# Altium project Tracking Radar PCB.PrjPcb (part 1 of 2)
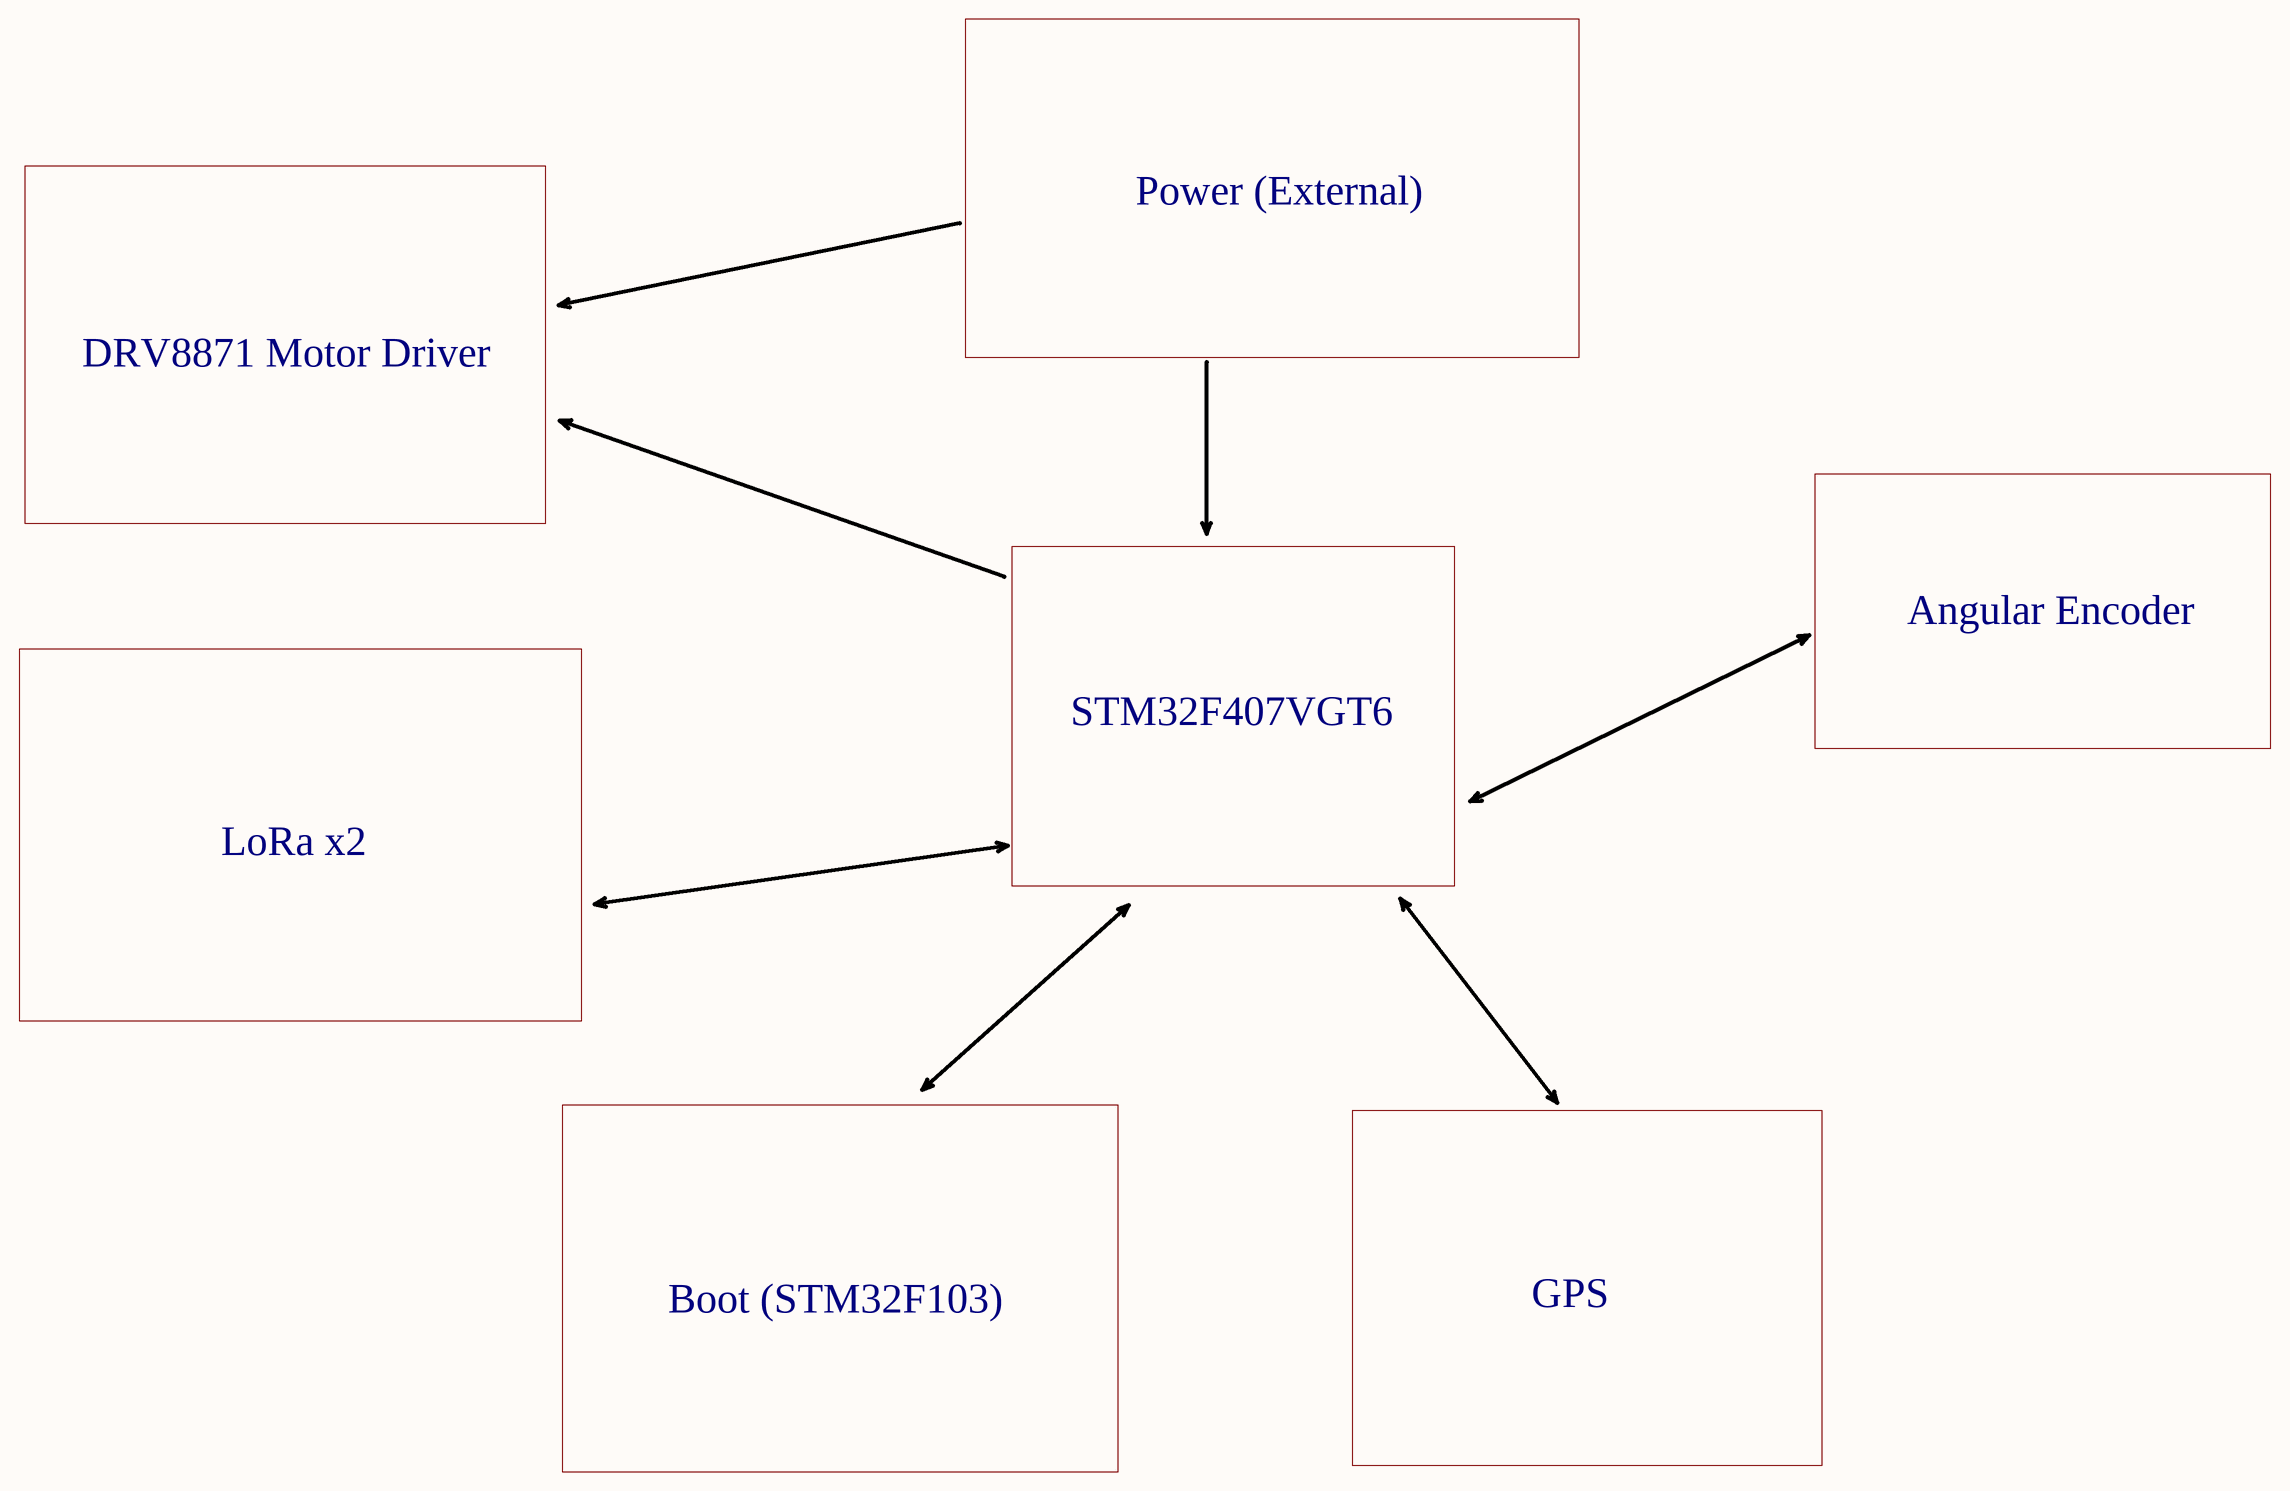
[diagram p0: Block Diagram.SchDoc]
9 sheets, 110 parts. Net scope: flat (ports and power ports of the same name join across sheets).
Board file: PCB.PcbDoc
Sheets:
  Block Diagram.SchDoc
  Power budget.SchDoc
  Power Management.SchDoc
  Motor_Drivers.SchDoc
  Microcontroller.SchDoc
  Debugger.SchDoc
  LoRa_Com.SchDoc
  GPS_GNSS.SchDoc
  Angular_Encoder.SchDoc

## Sheet Block Diagram.SchDoc
size A1; Author: İlker KESER; Revision: V1.0; SheetNumber: 1; SheetTotal: 9; Page: 1; Page Total: 9; Template: A1; Project Code: 02050838

### Notes on the sheet
- Power (External)
- DRV8871 Motor Driver
- Angular Encoder
- STM32F407VGT6
- LoRa x2
- Boot (STM32F103)
- GPS
- TITLE:
- DOCUMENT NAME:
- PROJECT CODE:
- TEMPLATE:
- AUTHOR:
- REVISION:
- Sheet:
- of

## Sheet Power budget.SchDoc
size A2; Author: İlker KESER; Revision: V1.0; SheetNumber: 2; SheetTotal: 9; Page: 2; Page Total: 9; Project Code: 02050838; Template: A2
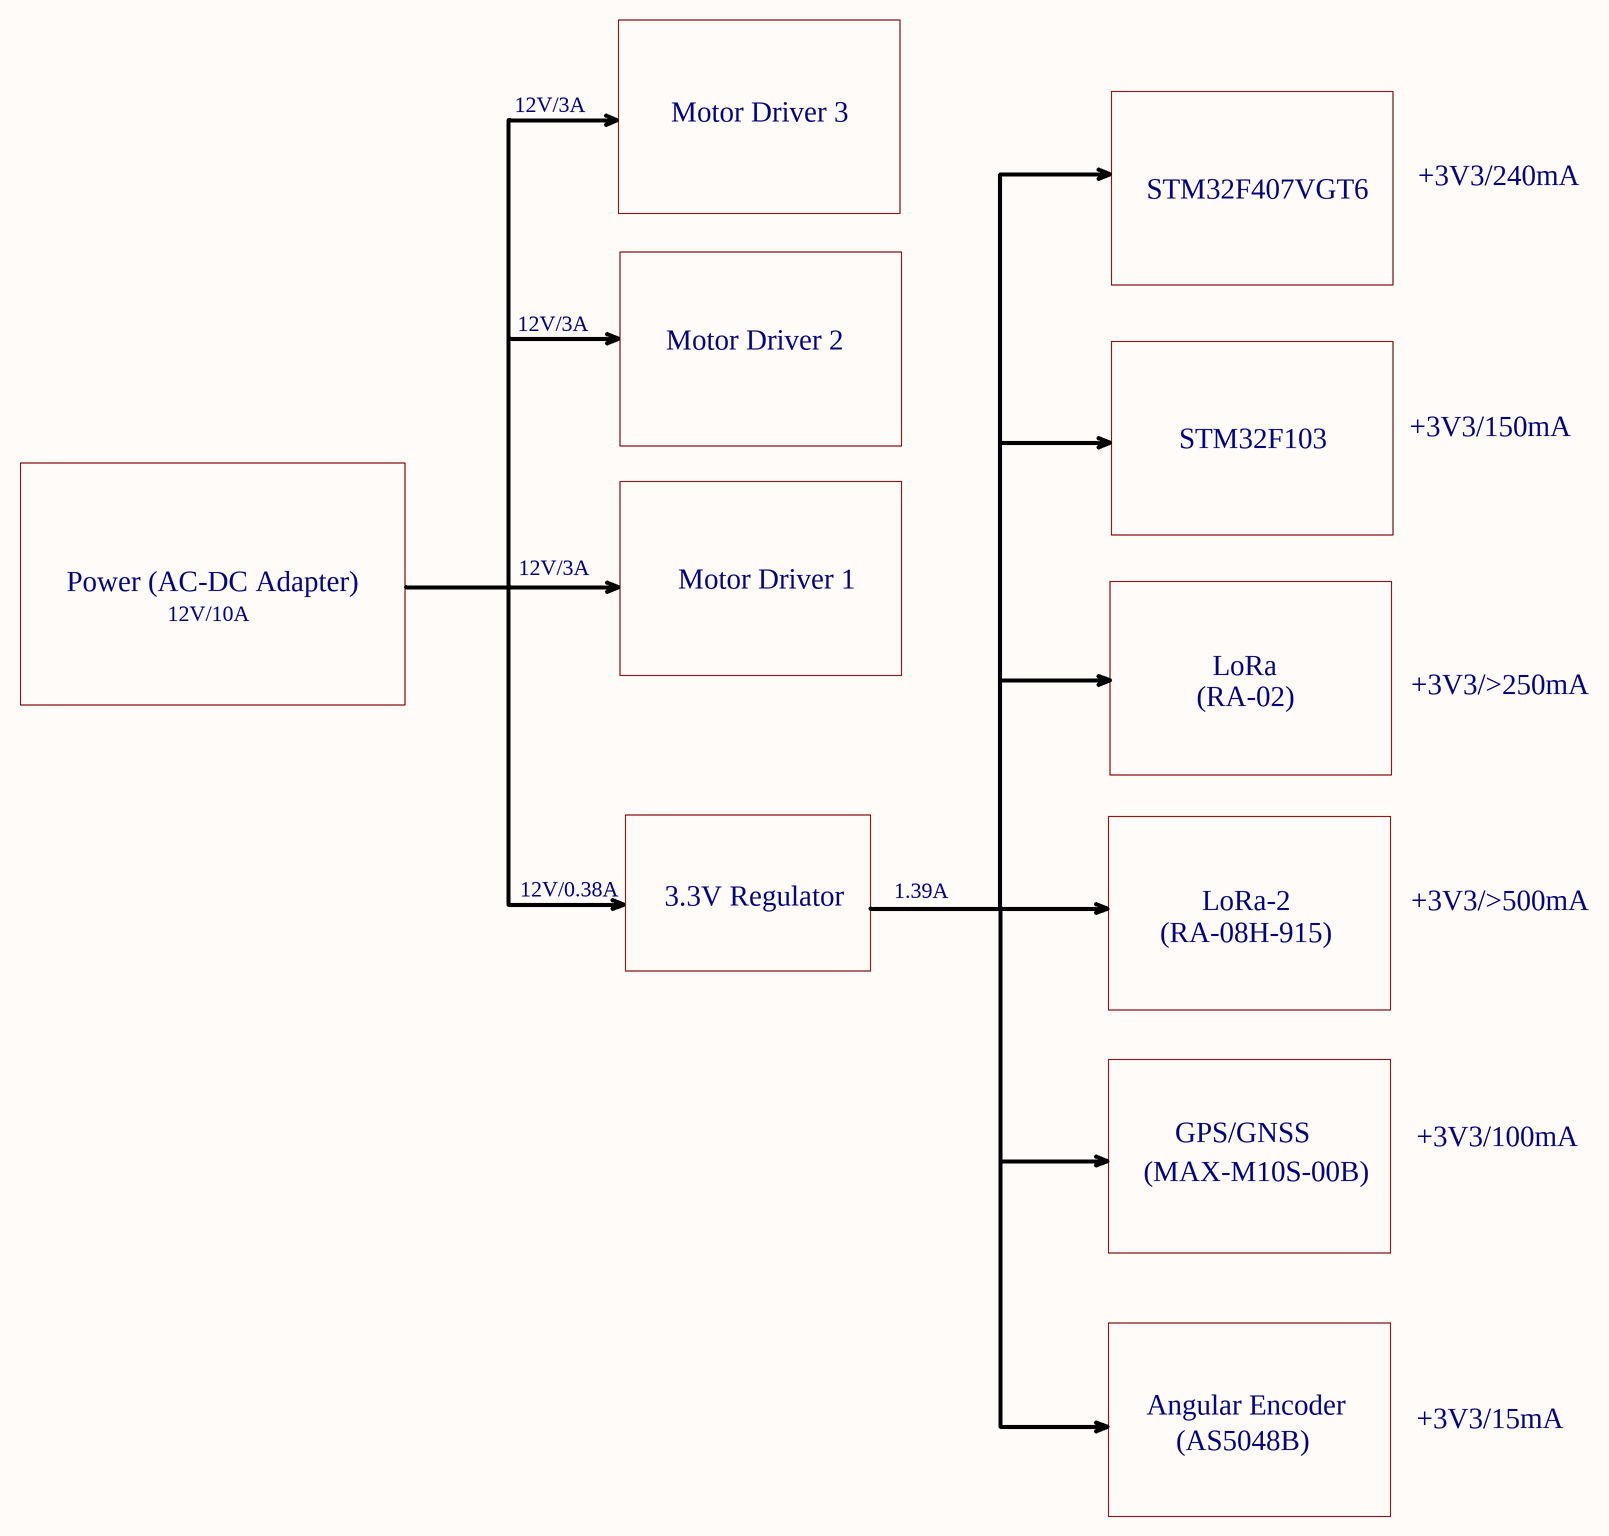
[diagram p1: Power budget.SchDoc]

### Notes on the sheet
- 12V/3A
- Motor Driver 3
- STM32F407VGT6
- +3V3/240mA
- Motor Driver 2
- STM32F103
- +3V3/150mA
- Power (AC-DC Adapter)
- 12V/10A
- Motor Driver 1
- LoRa
- +3V3/>250mA
- (RA-02)
- 12V/0.38A
- 1.39A
- 3.3V Regulator
- (RA-08H-915)
- LoRa-2
- +3V3/>500mA
- GPS/GNSS
- +3V3/100mA
- (MAX-M10S-00B)
- Angular Encoder
- +3V3/15mA
- (AS5048B)
- TITLE:
- DOCUMENT NAME:
- PROJECT CODE:
- TEMPLATE:
- AUTHOR:
- REVISION:
- Sheet:
- of

## Sheet Power Management.SchDoc
size A4; Author: İlker KESER; Revision: V1.0; SheetNumber: 3; SheetTotal: 9; Page: 3; Project Code: 02050838; Template: A4; Page Total: 9
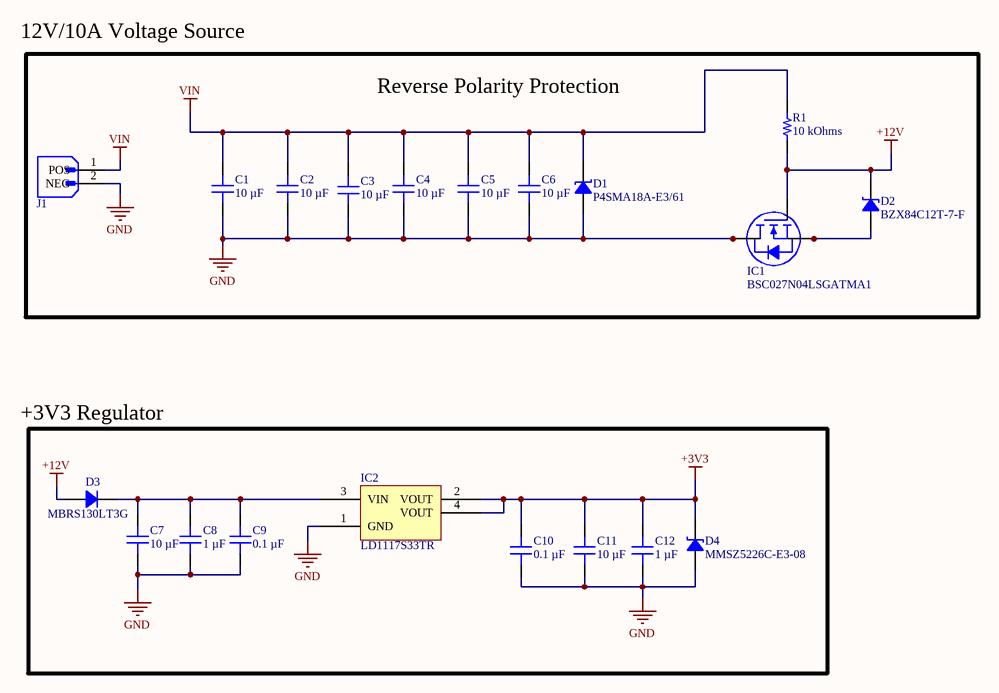
[diagram p2: Power Management.SchDoc]

### Parts
C1  10 µF  [MURATA CAP GRM31M 1206_3216]
C2  10 µF  [MURATA CAP GRM31M 1206_3216]
C3  10 µF  [MURATA CAP GRM31M 1206_3216]
C4  10 µF  [MURATA CAP GRM31M 1206_3216]
C5  10 µF  [MURATA CAP GRM31M 1206_3216]
C6  10 µF  [MURATA CAP GRM31M 1206_3216]
C7  10 µF  [CAP 0603_1608]
C8  1 µF  [MURATA GCM188 0603_1608]
C9  0.1 µF  [CAP 0603_1608]
C10  0.1 µF  [CAP 0603_1608]
C11  10 µF  [CAP 0603_1608]
C12  1 µF  [MURATA GCM188 0603_1608]
D1  P4SMA18A-E3/61  [DO214AC SMA]
D2  BZX84C12T-7-F  [DIODES SOT-523]
D3  MBRS130LT3G  [DO214AA SMB]
D4  MMSZ5226C-E3-08  [SOD-123]
IC1  BSC027N04LSGATMA1  [INFINEON PG-TDSON-8 6.15X5.32MM]
IC2  LD1117S33TR  [ST SOT-223]
J1  XT90 Connector  [XT90 Conn]  (value not drawn)
R1  10 kOhms  [YAGEO RES 0603_1608]

### Blocks framed on the sheet
Reverse Polarity Protection: C1-C6 D1 D2 IC1 J1 R1

### Nets
+3V3: C10.2 C11.2 C12.2 D4.2 IC2.2(VOUT) IC2.4(VOUT)
+12V: D2.2 D3.1 IC1.4(G) R1.1
GND: C1.1 C2.1 C3.1 C4.1 C5.1 C6.1 C7.1 C8.1 C9.1 C10.1 C11.1 C12.1 D1.1 D4.1 IC1.5(D) IC1.6(D) IC1.7(D) IC1.8(D) IC2.1(GND) J1.2(NEG)
VIN: C1.2 C2.2 C3.2 C4.2 C5.2 C6.2 D1.2 J1.1(POS) R1.2
NetC7_2: C7.2 C8.2 C9.2 D3.2 IC2.3(VIN)
NetD2_1: D2.1 IC1.1(S) IC1.2(S) IC1.3(S)

### Notes on the sheet
- 12V/10A Voltage Source
- +3V3 Regulator
- TITLE:
- DOCUMENT NAME:
- PROJECT CODE:
- TEMPLATE:
- REVISION:
- Sheet:
- of
- AUTHOR:

### Library data of the parts
C1-C6 = GRM319R61E106MA12D: CAP CER 10UF 25V X5R 1206; manufacturer: Murata Electronics; Tolerance: ±20%; Part Number: GRM319R61E106MA12D; Capacitance: 10 µF; Applications: General Purpose; componentlink1description: Datasheet; componentlink1url: https://search.murata.co.jp/Ceramy/image/img/A01X/G101/ENG/GRM319R61E106MA12-01A.pdf; componentlink2description: DigiKey Link; componentlink2url: https://www.digikey.com/en/products/detail/murata-electronics/GRM319R61E106MA12D/8323880; Device Package: 1206 (3216 Metric); lastupdated: 25.07.2024 10:41:13; Lifecycle Status: Active; Minimum Order: 1; Mounting Type: Surface Mount, MLCC; Operating Temperature: -55°C ~ 85°C; Package / Case: 1206 (3216 Metric); packaging: TapeAndReel; partid: 59156; price: 0.05; series: GRM; Size / Dimension: 0.126" L x 0.063" W (3.20mm x 1.60mm); Supplier 1: DigiKey; Supplier Part Number 1: 490-GRM319R61E106MA12DCT-ND; Temperature Coefficient: X5R; Thickness (Max): 0.037" (0.95mm); value: 10 µF; Voltage - Rated: 25V
C7 C11 = CC0603MRX5R7BB106: CAP CER 10UF 16V X5R 0603; manufacturer: Yageo; Tolerance: ±20%; Part Number: CC0603MRX5R7BB106; Capacitance: 10 µF; Applications: General Purpose; componentlink1description: Datasheet; componentlink1url: https://www.yageo.com/upload/media/product/productsearch/datasheet/mlcc/UPY-GPHC_X5R_4V-to-50V_26.pdf; componentlink2description: DigiKey Link; componentlink2url: https://www.digikey.com/en/products/detail/yageo/CC0603MRX5R7BB106/5195229; Device Package: 0603 (1608 Metric); lastupdated: 9.02.2024 20:09:51; Lifecycle Status: Active; Minimum Order: 1; Mounting Type: Surface Mount, MLCC; Operating Temperature: -55°C ~ 85°C; Package / Case: 0603 (1608 Metric); packaging: TapeAndReel; partid: 41163; Part Status: Active; price: 0.08; series: CC; Size / Dimension: 0.063" L x 0.031" W (1.60mm x 0.80mm); Supplier 1: DigiKey; Supplier Part Number 1: 311-1822-1-ND; Temperature Coefficient: X5R; Thickness (Max): 0.035" (0.90mm); value: 10 µF; Voltage - Rated: 16V
C8 C12 = GCM188R71C105KA64J: CAP CER 1UF 16V X7R 0603; manufacturer: Murata Electronics; Tolerance: ±10%; Part Number: GCM188R71C105KA64J; Capacitance: 1 µF; Applications: Automotive; componentlink1description: Datasheet; componentlink1url: https://www.murata.com/~/media/webrenewal/support/library/catalog/products/capacitor/mlcc/c03e.ashx?la=en-us; componentlink2description: DigiKey Link; componentlink2url: https://www.digikey.com/en/products/detail/murata-electronics/GCM188R71C105KA64J/4903955; Device Package: 0603 (1608 Metric); lastupdated: 20.07.2024 00:25:01; Lifecycle Status: Active; Minimum Order: 1; Mounting Type: Surface Mount, MLCC; Operating Temperature: -55°C ~ 125°C; Package / Case: 0603 (1608 Metric); packaging: TapeAndReel; partid: 13992; Part Status: Active; price: 0.02; Ratings: AEC-Q200; series: GCM; Size / Dimension: 0.063" L x 0.031" W (1.60mm x 0.80mm); Supplier 1: DigiKey; Supplier Part Number 1: 490-12657-1-ND; Temperature Coefficient: X7R; Thickness (Max): 0.035" (0.90mm); value: 1 µF; Voltage - Rated: 16V
C9 C10 = C0603X104M3RAC7867: CAP CER 0.1UF 25V X7R 0603; manufacturer: KEMET; Tolerance: ±20%; Part Number: C0603X104M3RAC7867; Capacitance: 0.1 µF; Applications: Boardflex Sensitive; componentlink1description: Datasheet; componentlink1url: https://api.kemet.com/component-edge/download/datasheet/C0603X104M3RACTU.pdf; componentlink2description: DigiKey Link; componentlink2url: https://www.digikey.com/en/products/detail/kemet/C0603X104M3RAC7867/2202613; Device Package: 0603 (1608 Metric); Features: Soft Termination; lastupdated: 9.02.2024 20:10:30; Lifecycle Status: Active; Minimum Order: 1; Mounting Type: Surface Mount, MLCC; Operating Temperature: -55°C ~ 125°C; Package / Case: 0603 (1608 Metric); packaging: TapeAndReel; partid: 2484; Part Status: Active; price: 0.06; series: SMD Comm X7R Flex; Size / Dimension: 0.063" L x 0.031" W (1.60mm x 0.80mm); Supplier 1: DigiKey; Supplier Part Number 1: 399-13148-1-ND; Temperature Coefficient: X7R; Thickness (Max): 0.034" (0.87mm); value: 0.1 µF; Voltage - Rated: 25V
D1 = P4SMA18A-E3/61: TVS DIODE 15.3V 25.2V DO214AC; Manufacturer: Vishay Semiconductor Diodes Division; Current - Peak Pulse (10/1000µs): 15.9A; Power Line Protection: No; Power - Peak Pulse: 400W; Type: Zener; Unidirectional Channels: 1; Voltage - Breakdown (Min): 17.1V; Part Number: P4SMA18A-E3/61; Applications: General Purpose; ComponentLink1Description: Datasheet; ComponentLink1URL: http://www.vishay.com/docs/88367/p4sma.pdf; ComponentLink2Description: DigiKey Link; ComponentLink2URL: http://digikey.com/product-detail/en/vishay-semiconductor-diodes-division/P4SMA18A-E3-61/P4SMA18A-E3-61GICT-ND/5639034; LastUpdated: 3.06.2024 19:57:21; Lifecycle Status: Active; Minimum Order: 1; Mounting Type: Surface Mount; Operating Temperature: -65°C ~ 150°C (TJ); Package / Case: DO-214AC, SMA; Packaging: TapeAndReel; PartId: 5591; Part Status: Active; Price: 0.10; Series: P4SMA, TransZorb®; Supplier 1: DigiKey; Supplier Part Number 1: P4SMA18A-E3/61GICT-ND; Supplier Device Package: DO-214AC (SMA); Voltage - Clamping (Max) @ Ipp: 25.2V; Voltage - Reverse Standoff (Typ): 15.3V
D2 = BZX84C12T-7-F: DIODE ZENER 12V 150MW SOT523; Manufacturer: Diodes Incorporated; Current - Reverse Leakage @ Vr: 100 nA @ 8 V; Impedance (Max) (Zzt): 25 Ohms; Tolerance: ±5%; Voltage - Forward (Vf) (Max) @ If: 900 mV @ 10 mA; Part Number: BZX84C12T-7-F; ComponentLink1Description: Datasheet; ComponentLink1URL: https://www.diodes.com/assets/Datasheets/ds30262.pdf; ComponentLink2Description: DigiKey Link; ComponentLink2URL: https://www.digikey.com/en/products/detail/diodes-incorporated/BZX84C12T-7-F/1934510; LastUpdated: 3.06.2024 20:01:51; Lifecycle Status: Active; Minimum Order: 1; Mounting Type: Surface Mount; Operating Temperature: -65°C ~ 150°C; Package / Case: SOT-523; Packaging: TapeAndReel; PartId: 779; Part Status: Active; Power - Max: 150 mW; Price: 0.04; Series: -; Supplier 1: DigiKey; Supplier Part Number 1: BZX84C12T-7-FDICT-ND; Supplier Device Package: SOT-523; Voltage - Zener (Nom) (Vz): 12 V
D3 = MBRS130LT3G: DIODE SCHOTTKY 30V 2A SMB; Manufacturer: ON Semiconductor; Current - Reverse Leakage @ Vr: 1mA @ 30V; Speed: Fast Recovery =< 500ns, > 200mA (Io); Voltage - Forward (Vf) (Max) @ If: 445mV @ 2A; Part Number: MBRS130LT3G; ComponentLink1Description: Datasheet; ComponentLink1URL: https://www.onsemi.com/pub/Collateral/MBRS130LT3-D.PDF; ComponentLink2Description: DigiKey Link; ComponentLink2URL: http://digikey.com/product-detail/en/on-semiconductor/MBRS130LT3G/MBRS130LT3GOSCT-ND/918000; Current - Average Rectified (Io): 2A; Diode Type: Schottky; LastUpdated: 3.06.2024 19:54:02; Lifecycle Status: Active; Minimum Order: 1; Mounting Type: Surface Mount; Operating Temperature - Junction: -65°C ~ 125°C; Package / Case: DO-214AA, SMB; Packaging: TapeAndReel; PartId: 1388; Part Status: Active; Price: 0.09; Series: -; Supplier 1: DigiKey; Supplier Part Number 1: MBRS130LT3GOSCT-ND; Supplier Device Package: SMB; Voltage - DC Reverse (Vr) (Max): 30V
D4 = MMSZ5226C-E3-08: DIODE ZENER 3.3V 500MW SOD123; Manufacturer: Vishay Semiconductor Diodes Division; Current - Reverse Leakage @ Vr: 25µA @ 1V; Impedance (Max) (Zzt): 28 Ohms; Tolerance: ±2%; Part Number: MMSZ5226C-E3-08; ComponentLink1Description: Datasheet; ComponentLink1URL: http://www.vishay.com/docs/85774/mmsz5225.pdf; ComponentLink2Description: DigiKey Link; ComponentLink2URL: http://digikey.com/product-detail/en/vishay-semiconductor-diodes-division/MMSZ5226C-E3-08/MMSZ5226C-E3-08GICT-ND/7717476; LastUpdated: 3.06.2024 19:55:49; Lifecycle Status: Active; Minimum Order: 1; Mounting Type: Surface Mount; Operating Temperature: -55°C ~ 150°C; Package / Case: SOD-123; Packaging: TapeAndReel; PartId: 1697; Part Status: Active; Power - Max: 500mW; Price: 0.06; Series: Automotive, AEC-Q101; Supplier 1: DigiKey; Supplier Part Number 1: MMSZ5226C-E3-08GICT-ND; Supplier Device Package: SOD-123; Voltage - Zener (Nom) (Vz): 3.3V
IC1 = BSC027N04LSGATMA1: MOSFET N-CH 40V 24A/100A TDSON; Manufacturer: Infineon Technologies; Current - Continuous Drain (Id) @ 25°C: 24A (Ta), 100A (Tc); Drive Voltage (Max Rds On,  Min Rds On): 4.5V, 10V; FET Type: N-Channel; Gate Charge (Qg) (Max) @ Vgs: 85 nC @ 10 V; Input Capacitance (Ciss) (Max) @ Vds: 6800 pF @ 20 V; Power Dissipation (Max): 2.5W (Ta), 83W (Tc); Rds On (Max) @ Id, Vgs: 2.7mOhm @ 50A, 10V; Vgs (Max): ±20V; Vgs(th) (Max) @ Id: 2V @ 49µA; Part Number: BSC027N04LSGATMA1; ComponentLink1Description: Datasheet; ComponentLink1URL: https://www.infineon.com/dgdl/BSC027N04LSG_rev1.04.pdf?folderId=db3a3043156fd5730115c7d50620107c&fileId=db3a30431689f4420116c4323646080c; ComponentLink2Description: DigiKey Link; ComponentLink2URL: https://www.digikey.com/en/products/detail/infineon-technologies/BSC027N04LSGATMA1/2080616; Drain to Source Voltage (Vdss): 40 V; LastUpdated: 3.06.2024 20:19:55; Lifecycle Status: Active; Minimum Order: 1; Mounting Type: Surface Mount; Operating Temperature: -55°C ~ 150°C (TJ); Package / Case: 8-PowerTDFN; Packaging: TapeAndReel; Part Status: Active; Price: 0.57; Series: OptiMOS™; Supplier 1: DigiKey; Supplier Part Number 1: BSC027N04LSGATMA1CT-ND; Supplier Device Package: PG-TDSON-8-1; Technology: MOSFET (Metal Oxide)
IC2 = LD1117S33TR: IC REG LINEAR 3.3V 800MA SOT223; Manufacturer: STMicroelectronics; Current - Quiescent (Iq): 10 mA; Number of Regulators: 1; Output Configuration: Positive; Output Type: Fixed; Protection Features: Over Current, Over Temperature; PSRR: 75dB (120Hz); Voltage Dropout (Max): 1.2V @ 800mA; Voltage - Input (Max): 15V; Part Number: LD1117S33TR; ComponentLink1Description: Datasheet; ComponentLink1URL: http://www.st.com/content/ccc/resource/technical/document/datasheet/99/3b/7d/91/91/51/4b/be/CD00000544.pdf/files/CD00000544.pdf/jcr:content/translations/en.CD00000544.pdf; ComponentLink2Description: DigiKey Link; ComponentLink2URL: https://www.digikey.com/en/products/detail/stmicroelectronics/LD1117S33TR/585766; Current - Output: 800mA; LastUpdated: 3.06.2024 20:14:20; Lifecycle Status: Active; Minimum Order: 1; Mounting Type: Surface Mount; Operating Temperature: 0°C ~ 125°C; Package / Case: TO-261-4, TO-261AA; Packaging: TapeAndReel; Part Status: Active; Price: 0.13; Series: -; Supplier 1: DigiKey; Supplier Part Number 1: 497-1242-1-ND; Supplier Device Package: SOT-223; Voltage - Output (Min/Fixed): 3.3V
J1 = XT90 Connector: Li-Po battery connector
R1 = AA0603FR-0710KL: RES SMD 10K OHM 1% 1/10W 0603; Manufacturer: Yageo; Power (Watts): 0.1W, 1/10W; Temperature Coefficient: ±150ppm/°C; Part Number: AA0603FR-0710KL; Value: 10 kOhms; ComponentLink1Description: Datasheet; ComponentLink1URL: https://www.yageo.com/upload/media/product/productsearch/datasheet/rchip/PYu-AA_51_RoHS_L_3.pdf; ComponentLink2Description: DigiKey Link; ComponentLink2URL: https://www.digikey.com/en/products/detail/yageo/AA0603FR-0710KL/5888698; Composition: Thick Film; Device Package: 0603 (1608 Metric); Features: Anti-Sulfur, Automotive AEC-Q200, Moisture Resistant; Height - Seated (Max): 0.022" (0.55mm); LastUpdated: 25.07.2024 09:19:15; Lifecycle Status: Active; Minimum Order: 1; Number of Terminations: 2; Operating Temperature: -55°C ~ 155°C; Package / Case: 0603 (1608 Metric); Packaging: TapeAndReel; PartId: 64302; Part Status: Active; Price: 0.01; Ratings: AEC-Q200; Resistance: 10 kOhms; Series: AA; Size / Dimension: 0.063" L x 0.031" W (1.60mm x 0.80mm); Supplier 1: DigiKey; Supplier Part Number 1: 13-AA0603FR-0710KLCT-ND; Supplier Device Package: 0603; Tolerance: ±1%

## Sheet Motor_Drivers.SchDoc
size A3; Author: İlker KESER; Revision: V1.0; SheetNumber: 4; SheetTotal: 9; Page: 4; Page Total: 9; Template: A3; Project Code: 02050838
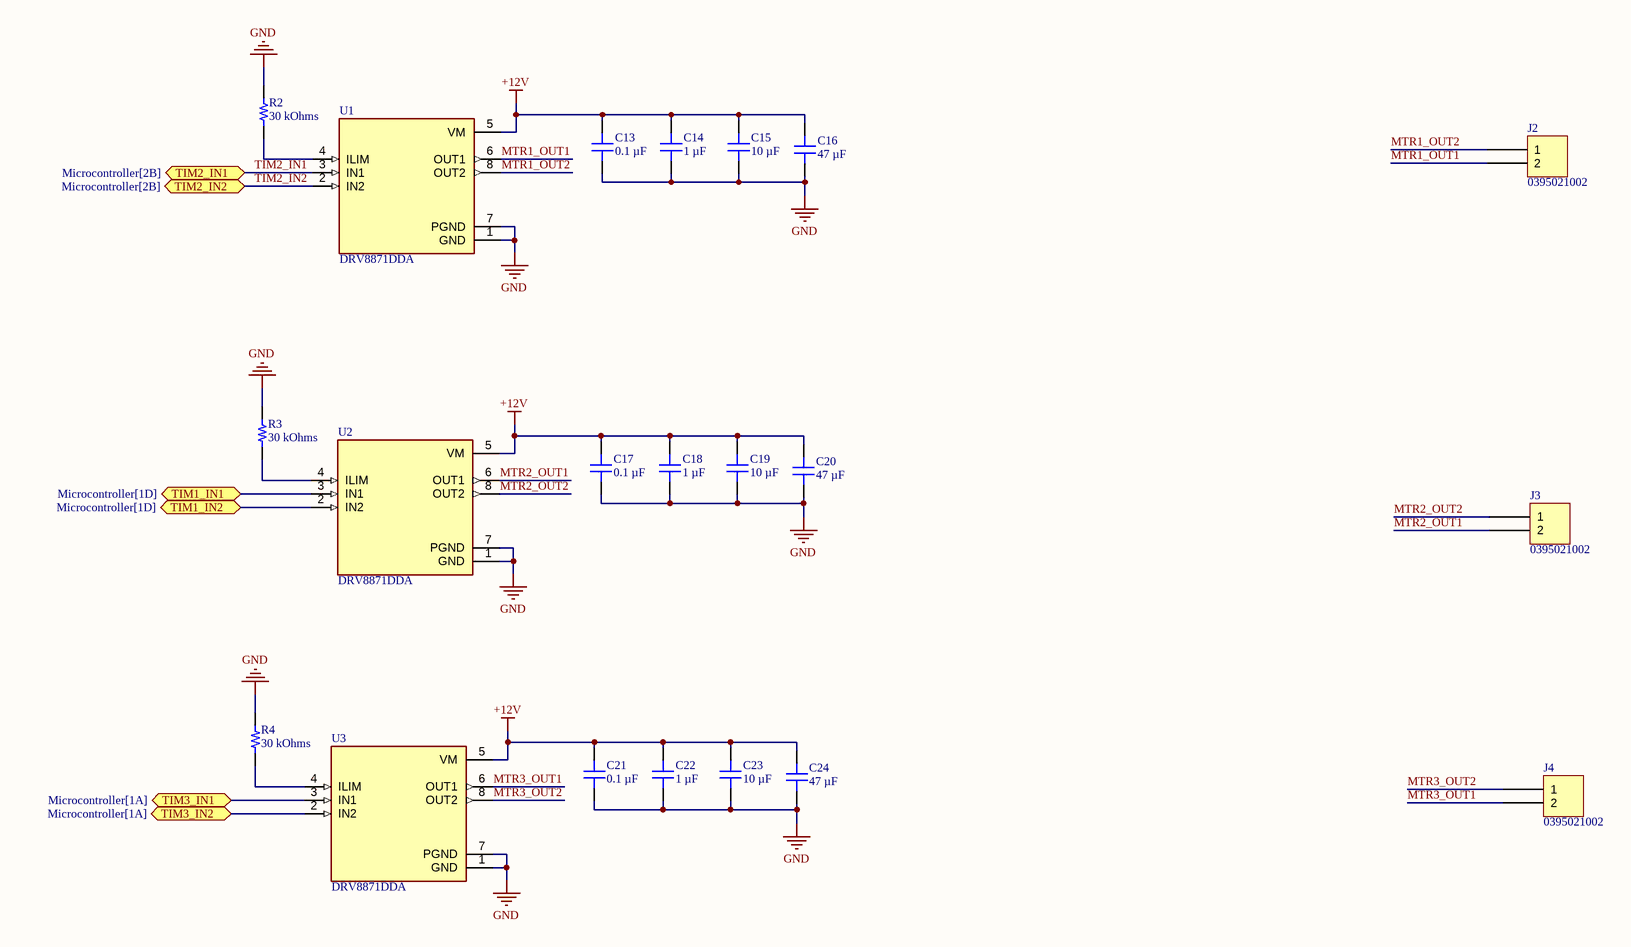
[diagram p3: Motor_Drivers.SchDoc]

### Parts
C13  0.1 µF  [CAP 0603_1608]
C14  1 µF  [MURATA GCM188 0603_1608]
C15  10 µF  [CAP 0603_1608]
C16  47 µF  [MURATA CAP GRM31C 1206_3216]
C17  0.1 µF  [CAP 0603_1608]
C18  1 µF  [MURATA GCM188 0603_1608]
C19  10 µF  [CAP 0603_1608]
C20  47 µF  [MURATA CAP GRM31C 1206_3216]
C21  0.1 µF  [CAP 0603_1608]
C22  1 µF  [MURATA GCM188 0603_1608]
C23  10 µF  [CAP 0603_1608]
C24  47 µF  [MURATA CAP GRM31C 1206_3216]
J2  0395021002  [MOLEX 395021002]
J3  0395021002  [MOLEX 395021002]
J4  0395021002  [MOLEX 395021002]
R2  30 kOhms  [YAGEO RES 0402_1005]
R3  30 kOhms  [YAGEO RES 0402_1005]
R4  30 kOhms  [YAGEO RES 0402_1005]
U1  DRV8871DDA  [DRV8871DDA]
U2  DRV8871DDA  [DRV8871DDA]
U3  DRV8871DDA  [DRV8871DDA]

### Ports
TIM1_IN1 (bidir, see Microcontroller[1D]), TIM1_IN2 (bidir, see Microcontroller[1D]), TIM2_IN1 (bidir, see Microcontroller[2B]), TIM2_IN2 (bidir, see Microcontroller[2B]), TIM3_IN1 (bidir, see Microcontroller[1A]), TIM3_IN2 (bidir, see Microcontroller[1A])

### Nets
+12V: C13.2 C14.2 C15.2 C16.2 C17.2 C18.2 C19.2 C20.2 C21.2 C22.2 C23.2 C24.2 U1.5(VM) U2.5(VM) U3.5(VM)
GND: C13.1 C14.1 C15.1 C16.1 C17.1 C18.1 C19.1 C20.1 C21.1 C22.1 C23.1 C24.1 R2.2 R3.2 R4.2 U1.1(GND) U1.7(PGND) U2.1(GND) U2.7(PGND) U3.1(GND) U3.7(PGND)
MTR1_OUT1: J2.2 U1.6(OUT1)
MTR1_OUT2: J2.1 U1.8(OUT2)
MTR2_OUT1: J3.2 U2.6(OUT1)
MTR2_OUT2: J3.1 U2.8(OUT2)
MTR3_OUT1: J4.2 U3.6(OUT1)
MTR3_OUT2: J4.1 U3.8(OUT2)
TIM2_IN1: U1.3(IN1) ; port TIM2_IN1
TIM2_IN2: U1.2(IN2) ; port TIM2_IN2
NetR2_1: R2.1 U1.4(ILIM)
NetR3_1: R3.1 U2.4(ILIM)
NetR4_1: R4.1 U3.4(ILIM)
NetU2_2: U2.2(IN2) ; port TIM1_IN2
NetU2_3: U2.3(IN1) ; port TIM1_IN1
NetU3_2: U3.2(IN2) ; port TIM3_IN2
NetU3_3: U3.3(IN1) ; port TIM3_IN1

### Notes on the sheet
- TITLE:
- DOCUMENT NAME:
- PROJECT CODE:
- TEMPLATE:
- REVISION:
- Sheet:
- of
- AUTHOR:

### Library data of the parts
C13 C17 C21 = C0603X104M3RAC7867: as C9 on sheet Power Management; Part Number: C0603X104M3RAC7867; Capacitance: 0.1 µF; Applications: Boardflex Sensitive; componentlink1description: Datasheet; componentlink1url: https://api.kemet.com/component-edge/download/datasheet/C0603X104M3RACTU.pdf; componentlink2description: DigiKey Link; componentlink2url: https://www.digikey.com/en/products/detail/kemet/C0603X104M3RAC7867/2202613; Device Package: 0603 (1608 Metric); Features: Soft Termination; lastupdated: 9.02.2024 20:10:30; Lifecycle Status: Active; Minimum Order: 1; Mounting Type: Surface Mount, MLCC; Operating Temperature: -55°C ~ 125°C; Package / Case: 0603 (1608 Metric); packaging: TapeAndReel; partid: 2484; Part Status: Active; price: 0.06; series: SMD Comm X7R Flex; Size / Dimension: 0.063" L x 0.031" W (1.60mm x 0.80mm); Supplier 1: DigiKey; Supplier Part Number 1: 399-13148-1-ND; Temperature Coefficient: X7R; Thickness (Max): 0.034" (0.87mm); value: 0.1 µF; Voltage - Rated: 25V
C14 C18 C22 = GCM188R71C105KA64J: as C8 on sheet Power Management; Part Number: GCM188R71C105KA64J; Capacitance: 1 µF; Applications: Automotive; componentlink1description: Datasheet; componentlink1url: https://www.murata.com/~/media/webrenewal/support/library/catalog/products/capacitor/mlcc/c03e.ashx?la=en-us; componentlink2description: DigiKey Link; componentlink2url: https://www.digikey.com/en/products/detail/murata-electronics/GCM188R71C105KA64J/4903955; Device Package: 0603 (1608 Metric); lastupdated: 20.07.2024 00:25:01; Lifecycle Status: Active; Minimum Order: 1; Mounting Type: Surface Mount, MLCC; Operating Temperature: -55°C ~ 125°C; Package / Case: 0603 (1608 Metric); packaging: TapeAndReel; partid: 13992; Part Status: Active; price: 0.02; Ratings: AEC-Q200; series: GCM; Size / Dimension: 0.063" L x 0.031" W (1.60mm x 0.80mm); Supplier 1: DigiKey; Supplier Part Number 1: 490-12657-1-ND; Temperature Coefficient: X7R; Thickness (Max): 0.035" (0.90mm); value: 1 µF; Voltage - Rated: 16V
C15 C19 C23 = CC0603MRX5R7BB106: as C7 on sheet Power Management; Part Number: CC0603MRX5R7BB106; Capacitance: 10 µF; Applications: General Purpose; componentlink1description: Datasheet; componentlink1url: https://www.yageo.com/upload/media/product/productsearch/datasheet/mlcc/UPY-GPHC_X5R_4V-to-50V_26.pdf; componentlink2description: DigiKey Link; componentlink2url: https://www.digikey.com/en/products/detail/yageo/CC0603MRX5R7BB106/5195229; Device Package: 0603 (1608 Metric); lastupdated: 9.02.2024 20:09:51; Lifecycle Status: Active; Minimum Order: 1; Mounting Type: Surface Mount, MLCC; Operating Temperature: -55°C ~ 85°C; Package / Case: 0603 (1608 Metric); packaging: TapeAndReel; partid: 41163; Part Status: Active; price: 0.08; series: CC; Size / Dimension: 0.063" L x 0.031" W (1.60mm x 0.80mm); Supplier 1: DigiKey; Supplier Part Number 1: 311-1822-1-ND; Temperature Coefficient: X5R; Thickness (Max): 0.035" (0.90mm); value: 10 µF; Voltage - Rated: 16V
C16 C20 C24 = GRM31CR61E476ME44L: CAP CER 47UF 25V X5R 1206; manufacturer: Murata Electronics; Tolerance: ±20%; Part Number: GRM31CR61E476ME44L; Capacitance: 47 µF; Applications: General Purpose; componentlink2description: DigiKey Link; componentlink2url: https://www.digikey.com/en/products/detail/murata-electronics/GRM31CR61E476ME44L/7243446; Device Package: 1206 (3216 Metric); lastupdated: 6.09.2024 02:27:23; Lifecycle Status: Active; Minimum Order: 1; Mounting Type: Surface Mount, MLCC; Operating Temperature: -55°C ~ 85°C; Package / Case: 1206 (3216 Metric); packaging: CutTape; partid: 54228; Part Status: Active; price: 0.39; series: GRM; Size / Dimension: 0.126" L x 0.063" W (3.20mm x 1.60mm); Supplier 1: DigiKey; Supplier Part Number 1: 490-16268-2-ND; Temperature Coefficient: X5R; Thickness (Max): 0.071" (1.80mm); value: 47 µF; Voltage - Rated: 25V
J2-J4 = 0395021002: TERM BLOCK HDR 2POS 90DEG 3.5MM; Manufacturer: Molex; Current - UL: 8A; Header Orientation: 90°, Right Angle; Number of Levels: 1; Number of Positions: 2; Pitch: 0.138" (3.50mm); Voltage - UL: 300V; Part Number: 0395021002; Color: Black; ComponentLink1Description: Datasheet; ComponentLink1URL: https://www.molex.com/pdm_docs/sd/395021002_sd.pdf; ComponentLink2Description: DigiKey Link; ComponentLink2URL: http://digikey.com/product-detail/en/molex/0395021002/WM7770-ND/1280621; Contact Mating Finish: Tin; LastUpdated: 25.06.2020 15:44:05; Lifecycle Status: Active; Minimum Order: 1; Mounting Type: Through Hole; Operating Temperature: -40°C ~ 105°C; Packaging: Tray; Part Status: Active; Positions Per Level: 2; Price: 0.58; Series: Eurostyle ESE 39502; Supplier 1: DigiKey; Supplier Part Number 1: WM7770-ND; Termination Style: Solder; Type: Header, Male Pins, Shrouded (4 Side)
R2-R4 = RC0402FR-1330KL: RES 30K OHM 1% 1/16W 0402; Manufacturer: Yageo; Power (Watts): 0.063W, 1/16W; Temperature Coefficient: ±100ppm/°C; Part Number: RC0402FR-1330KL; Value: 30 kOhms; ComponentLink1Description: Datasheet; ComponentLink1URL: https://www.yageo.com/upload/media/product/productsearch/datasheet/rchip/PYu-RC_Group_51_RoHS_L_12.pdf; ComponentLink2Description: DigiKey Link; ComponentLink2URL: https://www.digikey.com/en/products/detail/yageo/RC0402FR-1330KL/16982146; Composition: Thick Film; Device Package: 0402 (1005 Metric); Features: Moisture Resistant; Height - Seated (Max): 0.016" (0.40mm); LastUpdated: 25.07.2024 09:17:59; Lifecycle Status: Active; Minimum Order: 1; Number of Terminations: 2; Operating Temperature: -55°C ~ 155°C; Package / Case: 0402 (1005 Metric); Packaging: CutTape; PartId: 76462; Part Status: Active; Price: 0.01; Resistance: 30 kOhms; Series: RC_L; Size / Dimension: 0.039" L x 0.020" W (1.00mm x 0.50mm); Supplier 1: DigiKey; Supplier Part Number 1: 13-RC0402FR-1330KLCT-ND; Supplier Device Package: 0402; Tolerance: ±1%
U1-U3 = DRV8871DDA: Unipolar Motor Driver NMOS PWM 8-SO PowerPad; Manufacturer: Texas Instrument; Motor Type - AC, DC: Brushed DC; Function: Driver - Fully Integrated, Control and Power Stage; Output Configuration: Full Bridge; Current - Output: 3.6A; Voltage - Supply: 6.5V ~ 45V; Motor Type - Stepper: Unipolar; Technology: NMOS; Interface: PWM; Applications: DC Motors, General Purpose, Stepper Motors; Voltage - Load: 6.5V ~ 45V; Operating Temperature: -40°C ~ 150°C (TJ); Mounting Type: Surface Mount; Package / Case: 8-PowerSOIC (0.154", 3.90mm Width); ComponentLink1Description: Datasheet; ComponentLink1URL: https://www.ti.com/lit/ds/symlink/drv8871.pdf?HQS=dis-dk-null-digikeymode-dsf-pf-null-wwe&ts=1746168243606&ref_url=https%253A%252F%252Fwww.ti.com%252Fgeneral%252Fdocs%252Fsuppproductinfo.tsp%253FdistId%253D10%2526gotoUrl%253Dhttps%253A%252F%252Fwww.ti.com%252Flit%252Fgpn%252Fdrv8871; ComponentLink2Description: Digikey Link; ComponentLink2URL: https://www.digikey.com/en/products/detail/texas-instruments/drv8871dda/6110574

## Sheet Microcontroller.SchDoc
size A4; Author: İlker Keser; Revision: V1.0; SheetNumber: 5; SheetTotal: 9; Page: 5; Page Total: 9; Project Code: 02050838; Template: A4
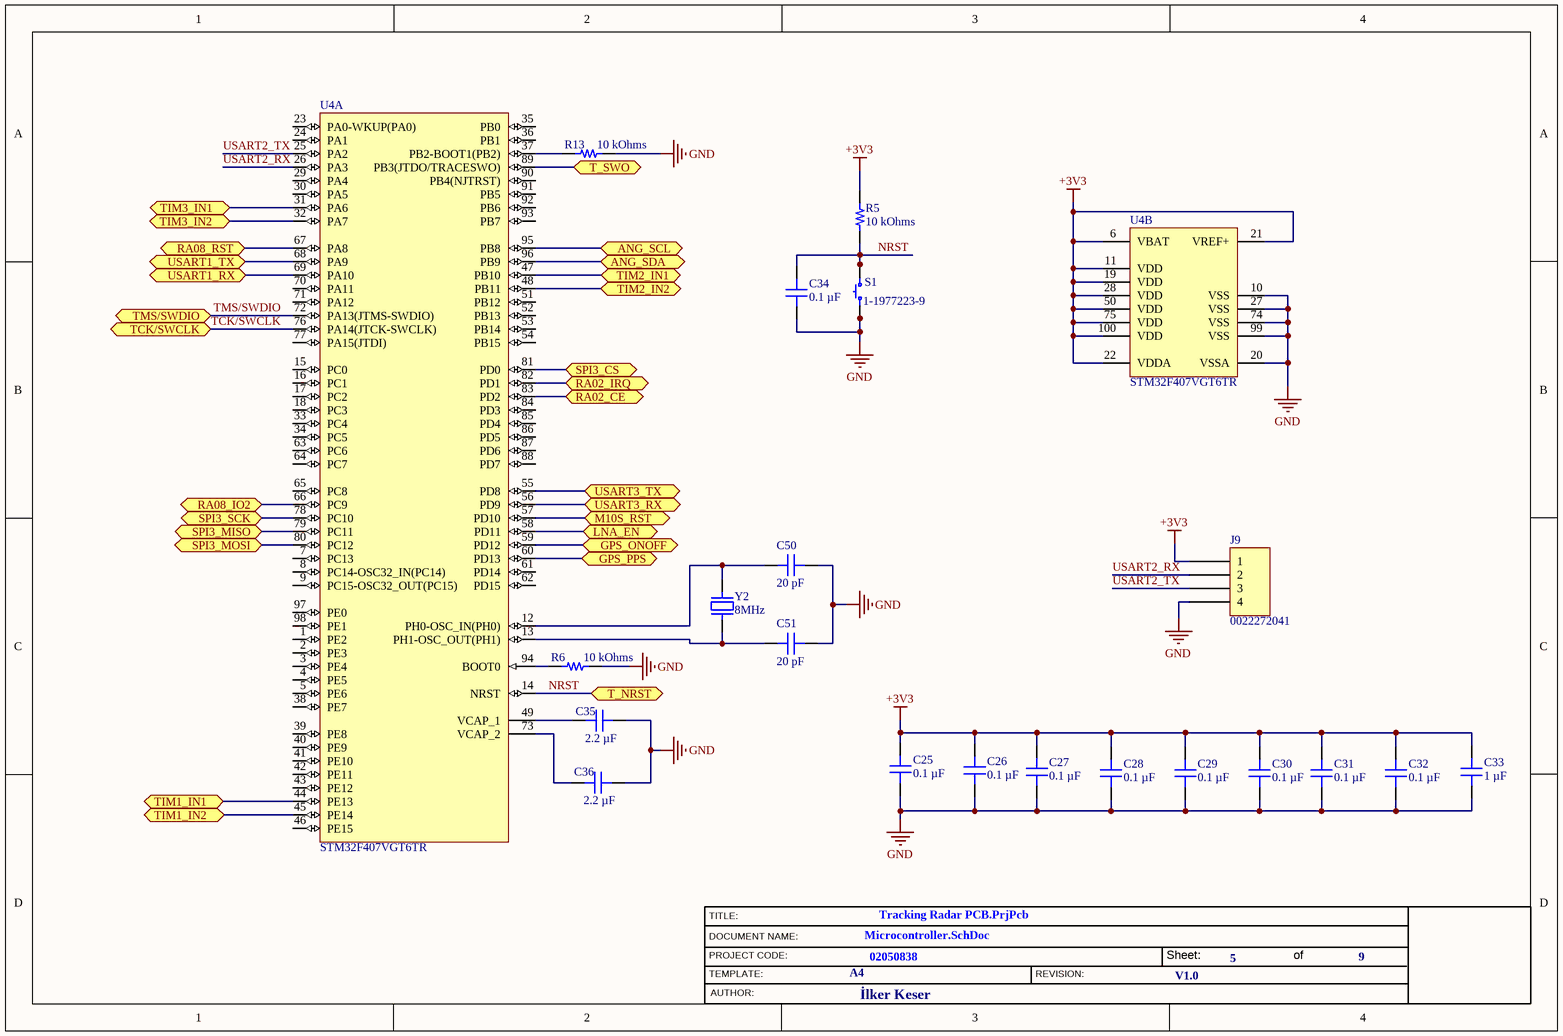
[diagram p4: Microcontroller.SchDoc]

### Parts
C25  0.1 µF  [CAP 0402_1005]
C26  0.1 µF  [CAP 0402_1005]
C27  0.1 µF  [CAP 0402_1005]
C28  0.1 µF  [CAP 0402_1005]
C29  0.1 µF  [CAP 0402_1005]
C30  0.1 µF  [CAP 0402_1005]
C31  0.1 µF  [CAP 0402_1005]
C32  0.1 µF  [CAP 0402_1005]
C33  1 µF  [CAP 0402_1005]
C34  0.1 µF  [CAP 0402_1005]
C35  2.2 µF  [CAP 0402_1005]
C36  2.2 µF  [CAP 0402_1005]
C50  20 pF  [CAP 0603_1608]
C51  20 pF  [CAP 0603_1608]
J9  0022272041  [MOLEX KK 0022272041]
R5  10 kOhms  [KOA RES RK73 RN73 0402_1005]
R6  10 kOhms  [YAGEO RES 0402_1005]
R13  10 kOhms  [YAGEO RES 0402_1005]
S1  1-1977223-9  [TE FSM6JSMA]
U4  STM32F407VGT6TR  [STM-LQFP100_N]  (parts A,B of 2)
Y2  8MHz  [TXC 9C]

### Ports
ANG_SCL (bidir, see Angular_Encoder[2B]), ANG_SDA (bidir, see Angular_Encoder[2B]), GPS_ONOFF (bidir, see GPS_GNSS[2B]), GPS_PPS (bidir, see GPS_GNSS[4B]), LNA_EN (bidir, see GPS_GNSS[4B]), M10S_RST (bidir, see GPS_GNSS[2B]), RA02_CE (bidir, see LoRa_Com[1C]), RA02_IRQ (bidir, see LoRa_Com[2C]), RA08_IO2 (bidir, see LoRa_Com[2B]), RA08_RST (bidir, see LoRa_Com[1B]), SPI3_CS (bidir, see LoRa_Com[1C]), SPI3_MISO (bidir, see LoRa_Com[1D]), SPI3_MOSI (bidir, see LoRa_Com[1D]), SPI3_SCK (bidir, see LoRa_Com[1C]), T_NRST (bidir, see Debugger[2D]), T_SWO (bidir, see Debugger[3C]), TCK/SWCLK (bidir, see Debugger[2B]), TIM1_IN1 (bidir, see Motor_Drivers[2B]), TIM1_IN2 (bidir, see Motor_Drivers[2B]), TIM2_IN1 (bidir, see Motor_Drivers[2A]), TIM2_IN2 (bidir, see Motor_Drivers[2A]), TIM3_IN1 (bidir, see Motor_Drivers[1C]), TIM3_IN2 (bidir, see Motor_Drivers[1C]), TMS/SWDIO (bidir, see Debugger[3C]), USART1_RX (bidir, see LoRa_Com[1B]), USART1_TX (bidir, see LoRa_Com[1B]), USART3_RX (bidir, see GPS_GNSS[4B]), USART3_TX (bidir, see GPS_GNSS[4B])

### Nets
+3V3: C25.2 C26.2 C27.2 C28.2 C29.2 C30.2 C31.2 C32.2 C33.2 J9.1 R5.1 U4.6(VBAT) U4.11(VDD) U4.19(VDD) U4.21(VREF+) U4.22(VDDA) U4.28(VDD) U4.50(VDD) U4.75(VDD) U4.100(VDD)
GND: C25.1 C26.1 C27.1 C28.1 C29.1 C30.1 C31.1 C32.1 C33.1 C34.1 C35.2 C36.2 C50.2 C51.2 J9.4 R6.2 R13.2 S1.1 S1.2 U4.10(VSS) U4.20(VSSA) U4.27(VSS) U4.74(VSS) U4.99(VSS)
ANT_SHORT_N: U4.59(PD12) ; port GPS_ONOFF
LNA_EN: U4.58(PD11) ; port LNA_EN
NRST: C34.2 R5.2 S1.3 S1.4 U4.14(NRST) ; port T_NRST
TCK/SWCLK: U4.76(PA14(JTCK-SWCLK)) ; port TCK/SWCLK  [project net STM_JTCK]
TIM2_IN1: U4.47(PB10) ; port TIM2_IN1
TIM2_IN2: U4.48(PB11) ; port TIM2_IN2
TMS/SWDIO: U4.72(PA13(JTMS-SWDIO)) ; port TMS/SWDIO  [project net STM_JTMS]
USART2_RX: J9.2 U4.26(PA3)
USART2_TX: J9.3 U4.25(PA2)
NetC35_1: C35.1 U4.49(VCAP_1)
NetC36_1: C36.1 U4.73(VCAP_2)
NetC50_1: C50.1 U4.12(PH0-OSC_IN(PH0)) Y2.2
NetC51_1: C51.1 U4.13(PH1-OSC_OUT(PH1)) Y2.1
NetR6_1: R6.1 U4.94(BOOT0)
NetR13_1: R13.1 U4.37(PB2-BOOT1(PB2))
NetR18_1: U4.95(PB8) ; port ANG_SCL
NetR19_1: U4.96(PB9) ; port ANG_SDA
NetU2_2: U4.45(PE14) ; port TIM1_IN2
NetU2_3: U4.44(PE13) ; port TIM1_IN1
NetU3_2: U4.32(PA7) ; port TIM3_IN2
NetU3_3: U4.31(PA6) ; port TIM3_IN1
NetU4_55: U4.55(PD8) ; port USART3_TX
NetU4_56: U4.56(PD9) ; port USART3_RX
NetU4_57: U4.57(PD10) ; port M10S_RST
NetU4_60: U4.60(PD13) ; port GPS_PPS
NetU4_66: U4.66(PC9) ; port RA08_IO2
NetU4_67: U4.67(PA8) ; port RA08_RST
NetU4_68: U4.68(PA9) ; port USART1_TX
NetU4_69: U4.69(PA10) ; port USART1_RX
NetU4_78: U4.78(PC10) ; port SPI3_SCK
NetU4_79: U4.79(PC11) ; port SPI3_MISO
NetU4_80: U4.80(PC12) ; port SPI3_MOSI
NetU4_81: U4.81(PD0) ; port SPI3_CS
NetU4_82: U4.82(PD1) ; port RA02_IRQ
NetU4_83: U4.83(PD2) ; port RA02_CE
NetU4_89: U4.89(PB3(JTDO/TRACESWO)) ; port T_SWO

Not connected (* = marked no-connect by the designer): U4 1(PE2) 2(PE3) 3(PE4) 4(PE5) 5(PE6) 7(PC13) 8(PC14-OSC32_IN(PC14)) 9(PC15-OSC32_OUT(PC15)) 15(PC0) 16(PC1) 17(PC2) 18(PC3) 23(PA0-WKUP(PA0)) 24(PA1) 29(PA4) 30(PA5) 33(PC4) 34(PC5) 35(PB0) 36(PB1) 38(PE7) 39(PE8) 40(PE9) 41(PE10) 42(PE11) 43(PE12) 46(PE15) 51(PB12) 52(PB13) 53(PB14) 54(PB15) 61(PD14) 62(PD15) 63(PC6) 64(PC7) 65(PC8) 70(PA11) 71(PA12) 77(PA15(JTDI)) 84(PD3) 85(PD4) 86(PD5) 87(PD6) 88(PD7) 90(PB4(NJTRST)) 91(PB5) 92(PB6) 93(PB7) 97(PE0) 98(PE1)

### Notes on the sheet
- TITLE:
- DOCUMENT NAME:
- PROJECT CODE:
- TEMPLATE:
- REVISION:
- Sheet:
- of
- AUTHOR:

### Library data of the parts
C25-C32 C34 = C0402C104M9PAC7867: CAP CER 0.1UF 6.3V X5R 0402; manufacturer: KEMET; Tolerance: ±20%; Part Number: C0402C104M9PAC7867; Capacitance: 0.1 µF; Applications: Bypass, Decoupling; componentlink1description: Datasheet; componentlink1url: https://api.kemet.com/component-edge/download/datasheet/C0402C104M9PACTU.pdf; componentlink2description: DigiKey Link; componentlink2url: https://www.digikey.com/en/products/detail/kemet/C0402C104M9PAC7867/2196244; Device Package: 0402 (1005 Metric); lastupdated: 9.02.2024 20:04:15; Lifecycle Status: Active; Minimum Order: 1; Mounting Type: Surface Mount, MLCC; Operating Temperature: -55°C ~ 85°C; Package / Case: 0402 (1005 Metric); packaging: CutTape; partid: 33676; Part Status: Active; price: 0.01; series: SMD Comm X5R; Size / Dimension: 0.039" L x 0.020" W (1.00mm x 0.50mm); Supplier 1: DigiKey; Supplier Part Number 1: 399-C0402C104M9PAC7867CT-ND; Temperature Coefficient: X5R; Thickness (Max): 0.022" (0.55mm); value: 0.1 µF; Voltage - Rated: 6.3V
C33 = GRM152R60J105ME15D: CAP CER 1UF 6.3V X5R 0402; manufacturer: Murata Electronics; Tolerance: ±20%; Part Number: GRM152R60J105ME15D; Capacitance: 1 µF; Applications: General Purpose; componentlink1description: Datasheet; componentlink1url: https://search.murata.co.jp/Ceramy/image/img/A01X/G101/ENG/GRM152R60J105ME15-01.pdf; componentlink2description: DigiKey Link; componentlink2url: https://www.digikey.com/en/products/detail/murata-electronics/GRM152R60J105ME15D/4904809; Device Package: 0402 (1005 Metric); lastupdated: 9.02.2024 20:04:33; Lifecycle Status: Active; Minimum Order: 1; Mounting Type: Surface Mount, MLCC; Operating Temperature: -55°C ~ 85°C; Package / Case: 0402 (1005 Metric); packaging: TapeAndReel; partid: 4147; Part Status: Active; price: 0.03; series: GRM; Size / Dimension: 0.039" L x 0.020" W (1.00mm x 0.50mm); Supplier 1: DigiKey; Supplier Part Number 1: 490-10006-1-ND; Temperature Coefficient: X5R; Thickness (Max): 0.009" (0.22mm); value: 1 µF; Voltage - Rated: 6.3V
C35 C36 = 885012105013: CAP CER 2.2UF 10V X5R 0402; manufacturer: Würth Elektronik; Tolerance: ±20%; Part Number: 885012105013; Capacitance: 2.2 µF; Applications: General Purpose; componentlink1description: Datasheet; componentlink1url: https://katalog.we-online.de/pbs/datasheet/885012105013.pdf; componentlink2description: DigiKey Link; componentlink2url: https://www.digikey.com/en/products/detail/würth-elektronik/885012105013/5453345; Device Package: 0402 (1005 Metric); lastupdated: 9.02.2024 20:04:19; Lifecycle Status: Active; Minimum Order: 1; Mounting Type: Surface Mount, MLCC; Operating Temperature: -55°C ~ 85°C; Package / Case: 0402 (1005 Metric); packaging: TapeAndReel; partid: 13152; Part Status: Active; price: 0.09; series: WCAP-CSGP; Size / Dimension: 0.039" L x 0.020" W (1.00mm x 0.50mm); Supplier 1: DigiKey; Supplier Part Number 1: 732-7490-1-ND; Temperature Coefficient: X5R; Thickness (Max): 0.022" (0.55mm); value: 2.2 µF; Voltage - Rated: 10V
C50 C51 = C0603C200G8HAC7867: CAP CER 20PF 10V X8R 0603; manufacturer: KEMET; Tolerance: ±2%; Part Number: C0603C200G8HAC7867; Capacitance: 20 pF; Applications: General Purpose; componentlink1description: Datasheet; componentlink1url: https://api.kemet.com/component-edge/download/datasheet/C0603C200G8HAC7867.pdf; componentlink2description: DigiKey Link; componentlink2url: https://www.digikey.com/en/products/detail/kemet/C0603C200G8HAC7867/7946222; Device Package: 0603 (1608 Metric); Features: Low ESL, High Temperature; lastupdated: 9.02.2024 20:09:59; Lifecycle Status: Active; Minimum Order: 1; Mounting Type: Surface Mount, MLCC; Operating Temperature: -55°C ~ 150°C; Package / Case: 0603 (1608 Metric); packaging: TapeAndReel; partid: 35714; Part Status: Active; price: 0.01; series: SMD Comm X8R HT150C; Size / Dimension: 0.063" L x 0.031" W (1.60mm x 0.80mm); Supplier 1: DigiKey; Supplier Part Number 1: 399-C0603C200G8HAC7867CT-ND; Temperature Coefficient: X8R; Thickness (Max): 0.034" (0.87mm); value: 20 pF; Voltage - Rated: 10V
J9 = 0022272041: CONN HEADER VERT 4POS 2.54MM; Manufacturer: Molex; Contact Length - Mating: 0.295" (7.49mm); Contact Length - Post: 0.140" (3.56mm); Material Flammability Rating: UL94 V-0; Number of Positions: 4; Number of Positions Loaded: All; Overall Contact Length: 0.560" (14.22mm); Pitch - Mating: 0.100" (2.54mm); Shrouding: Shrouded - 1 Wall; Style: Board to Cable/Wire; Part Number: 0022272041; ComponentLink1Description: Datasheet; ComponentLink1URL: https://www.molex.com/pdm_docs/sd/022272041_sd.pdf; ComponentLink2Description: DigiKey Link; ComponentLink2URL: http://digikey.com/product-detail/en/molex/0022272041/WM4113-ND/1130579; Connector Type: Header; Contact Finish - Mating: Tin; Contact Finish - Post: Tin; Contact Finish Thickness - Mating: 100.0µin (2.54µm); Contact Material: Brass; Contact Shape: Square; Contact Type: Male Pin; Fastening Type: Friction Lock; Insulation Color: Natural; Insulation Height: 0.461" (11.70mm); Insulation Material: Polyamide (PA), Nylon; LastUpdated: 12.01.2020 23:52:05; Lifecycle Status: Active; Minimum Order: 1; Mounting Type: Through Hole; Number of Rows: 1; Packaging: Bulk; PartId: 78; Part Status: Active; Price: 0.40; Series: KK 6410; Supplier 1: DigiKey; Supplier Part Number 1: WM4113-ND; Termination: Solder
R5 = RK73H1ETTP1002D: RES 10K OHM 0.5% 1/10W 0402; Manufacturer: KOA Speer Electronics, Inc.; Power (Watts): 0.1W, 1/10W; Temperature Coefficient: ±100ppm/°C; Part Number: RK73H1ETTP1002D; Value: 10 kOhms; ComponentLink1Description: Datasheet; ComponentLink1URL: http://www.koaspeer.com/catimages/Products/RK73H/RK73H.pdf; ComponentLink2Description: DigiKey Link; ComponentLink2URL: https://www.digikey.com/en/products/detail/koa-speer-electronics-inc/RK73H1ETTP1002D/9844692; Composition: Thick Film; Device Package: 0402 (1005 Metric); Features: Automotive AEC-Q200; Height - Seated (Max): 0.016" (0.40mm); LastUpdated: 25.07.2024 09:41:31; Lifecycle Status: Active; Minimum Order: 1; Number of Terminations: 2; Operating Temperature: -55°C ~ 155°C; Package / Case: 0402 (1005 Metric); Packaging: TapeAndReel; PartId: 14647; Part Status: Active; Price: 0.03; Ratings: AEC-Q200; Resistance: 10 kOhms; Series: RK73H; Size / Dimension: 0.039" L x 0.020" W (1.00mm x 0.50mm); Supplier 1: DigiKey; Supplier Part Number 1: 2019-RK73H1ETTP1002DCT-ND; Supplier Device Package: 0402; Tolerance: ±0.5%
R6 R13 = RP0402BRD0710KL: RES 10K OHM 0.1% 1/16W 0402; Manufacturer: Yageo; Power (Watts): 0.063W, 1/16W; Temperature Coefficient: ±25ppm/°C; Part Number: RP0402BRD0710KL; Value: 10 kOhms; ComponentLink1Description: Datasheet; ComponentLink1URL: https://www.yageo.com/upload/media/product/products/datasheet/rchip/PYu-RP_51_RoHS_L_0.pdf; ComponentLink2Description: DigiKey Link; ComponentLink2URL: https://www.digikey.com/en/products/detail/yageo/RP0402BRD0710KL/16916584; Composition: Thin Film; Device Package: 0402 (1005 Metric); Features: Anti-Sulfur, Automotive AEC-Q200, Moisture Resistant; Height - Seated (Max): 0.014" (0.35mm); LastUpdated: 25.07.2024 09:18:00; Lifecycle Status: Active; Minimum Order: 1; Number of Terminations: 2; Operating Temperature: -55°C ~ 155°C; Package / Case: 0402 (1005 Metric); Packaging: TapeAndReel; PartId: 70202; Part Status: Active; Price: 0.06; Resistance: 10 kOhms; Series: RP; Size / Dimension: 0.039" L x 0.020" W (1.00mm x 0.50mm); Supplier 1: DigiKey; Supplier Part Number 1: 13-RP0402BRD0710KLCT-ND; Supplier Device Package: 0402; Tolerance: ±0.1%
S1 = 1-1977223-9: SWITCH TACTILE SPST-NO 0.05A 24V; Manufacturer: TE Connectivity ALCOSWITCH Switches; Actuator Height off PCB, Vertical: 7.00mm; Actuator Orientation: Top Actuated; Actuator Type: Standard; Contact Rating @ Voltage: 0.05A @ 24VDC; Illumination: Non-Illuminated; Operating Force: 260gf; Outline: 6.00mm x 6.00mm; Switch Function: Off-Mom; Part Number: 1-1977223-9; Circuit: SPST-NO; ComponentLink1Description: Datasheet; ComponentLink1URL: https://www.te.com/commerce/DocumentDelivery/DDEController?Action=srchrtrv&DocNm=1308111-1_SWITCHES_CORE_PROGRAM_CATALOG&DocType=CS&DocLang=English; ComponentLink2Description: DigiKey Link; ComponentLink2URL: http://digikey.com/product-detail/en/te-connectivity-alcoswitch-switches/1-1977223-9/1-1977223-9-ND/5401299; LastUpdated: 3.06.2024 20:19:31; Lifecycle Status: Active; Minimum Order: 1500; Mounting Type: Surface Mount; Packaging: Bulk; Price: 0.36; Series: FSMJSMA; Supplier 1: DigiKey; Supplier Part Number 1: 1-1977223-9-ND; Termination Style: Gull Wing
U4 = STM32F407VGT6TR: ARM Cortex-M4 32-bit MCU+FPU, 210 DMIPS, 1024 kB Flash, 192 kB Internal RAM, 82 I/Os, 100-pin LQFP, -40 to 85 degC, Tape and Reel; Manufacturer: STMicroelectronics; D/A Converter: 2x12-bit; FLASH Size (Prog) (kB): 1024; I/Os (High Current): 82; Internal RAM Size (kB): 192; Operating Frequency(F) (Processor speed) (MHz): 168; Supply Voltage(Vcc) max (V): 3.6; Supply Voltage(Vcc) min (V): 1.8; DatasheetVersion: Rev. 4; PackageVersion: Rev. 1, 06/2013; PackageReference: LQFP100; PackageDescription: 100-Pin Low Profile Quad Flat Package, 14 x 14 mm Body, 0.5 mm Pitch; Supplier 1: Digi-Key; Supplier Part Number 1: STM32F407VGT6TR-ND; Supplier 2: Newark; Supplier Part Number 2: 99W9913; Supplier 3: Newark; Supplier Part Number 3: 43W6529; Supplier 4: Mouser; Supplier Part Number 4: 511-STM32F407VGT6TR; Core: ARM Cortex-M4; Packing: Tape and Reel; Mounting Technology: Surface Mount; PartNumber: STM32F407VGT6TR; ComponentLink1Description: Manufacturer URL; ComponentLink1URL: http://www.st.com/web/en/home.html; ComponentLink2Description: Datasheet; ComponentLink2URL: http://www.st.com/st-web-ui/static/active/en/resource/technical/document/datasheet/DM00037051.pdf; ComponentLink3Description: Package Specification; ComponentLink3URL: http://www.st.com/st-web-ui/static/active/en/resource/technical/document/data_brief/DM00071938.pdf
Y2 = 9C-8.000MBBK-T: CRYSTAL 8.0000MHZ 20PF SMD; Manufacturer: TXC CORPORATION; ESR (Equivalent Series Resistance): 80 Ohms; Frequency Stability: ±50ppm; Operating Mode: Fundamental; Part Number: 9C-8.000MBBK-T; ComponentLink1Description: Datasheet; ComponentLink1URL: http://www.txccorp.com/download/products/quartz_crystals/2015TXC_9C_32.pdf; ComponentLink2Description: DigiKey Link; ComponentLink2URL: http://digikey.com/product-detail/en/txc-corporation/9C-8.000MBBK-T/887-2475-1-ND/4475454; Frequency: 8MHz; Frequency Tolerance: ±50ppm; Height - Seated (Max): 0.161" (4.10mm); LastUpdated: 3.06.2024 20:02:24; Lifecycle Status: Active; Load Capacitance: 20pF; Minimum Order: 1; Mounting Type: Surface Mount; Operating Temperature: -20°C ~ 70°C; Package / Case: HC-49S; Packaging: TapeAndReel; PartId: 697; Part Status: Active; Price: 0.18; Series: 9C; Size / Dimension: 0.449" L x 0.189" W (11.40mm x 4.80mm); Supplier 1: DigiKey; Supplier Part Number 1: 887-2475-1-ND; Type: MHz Crystal; Value: 8MHz